# EAGLE design cape (EAGLE 7.4.0)
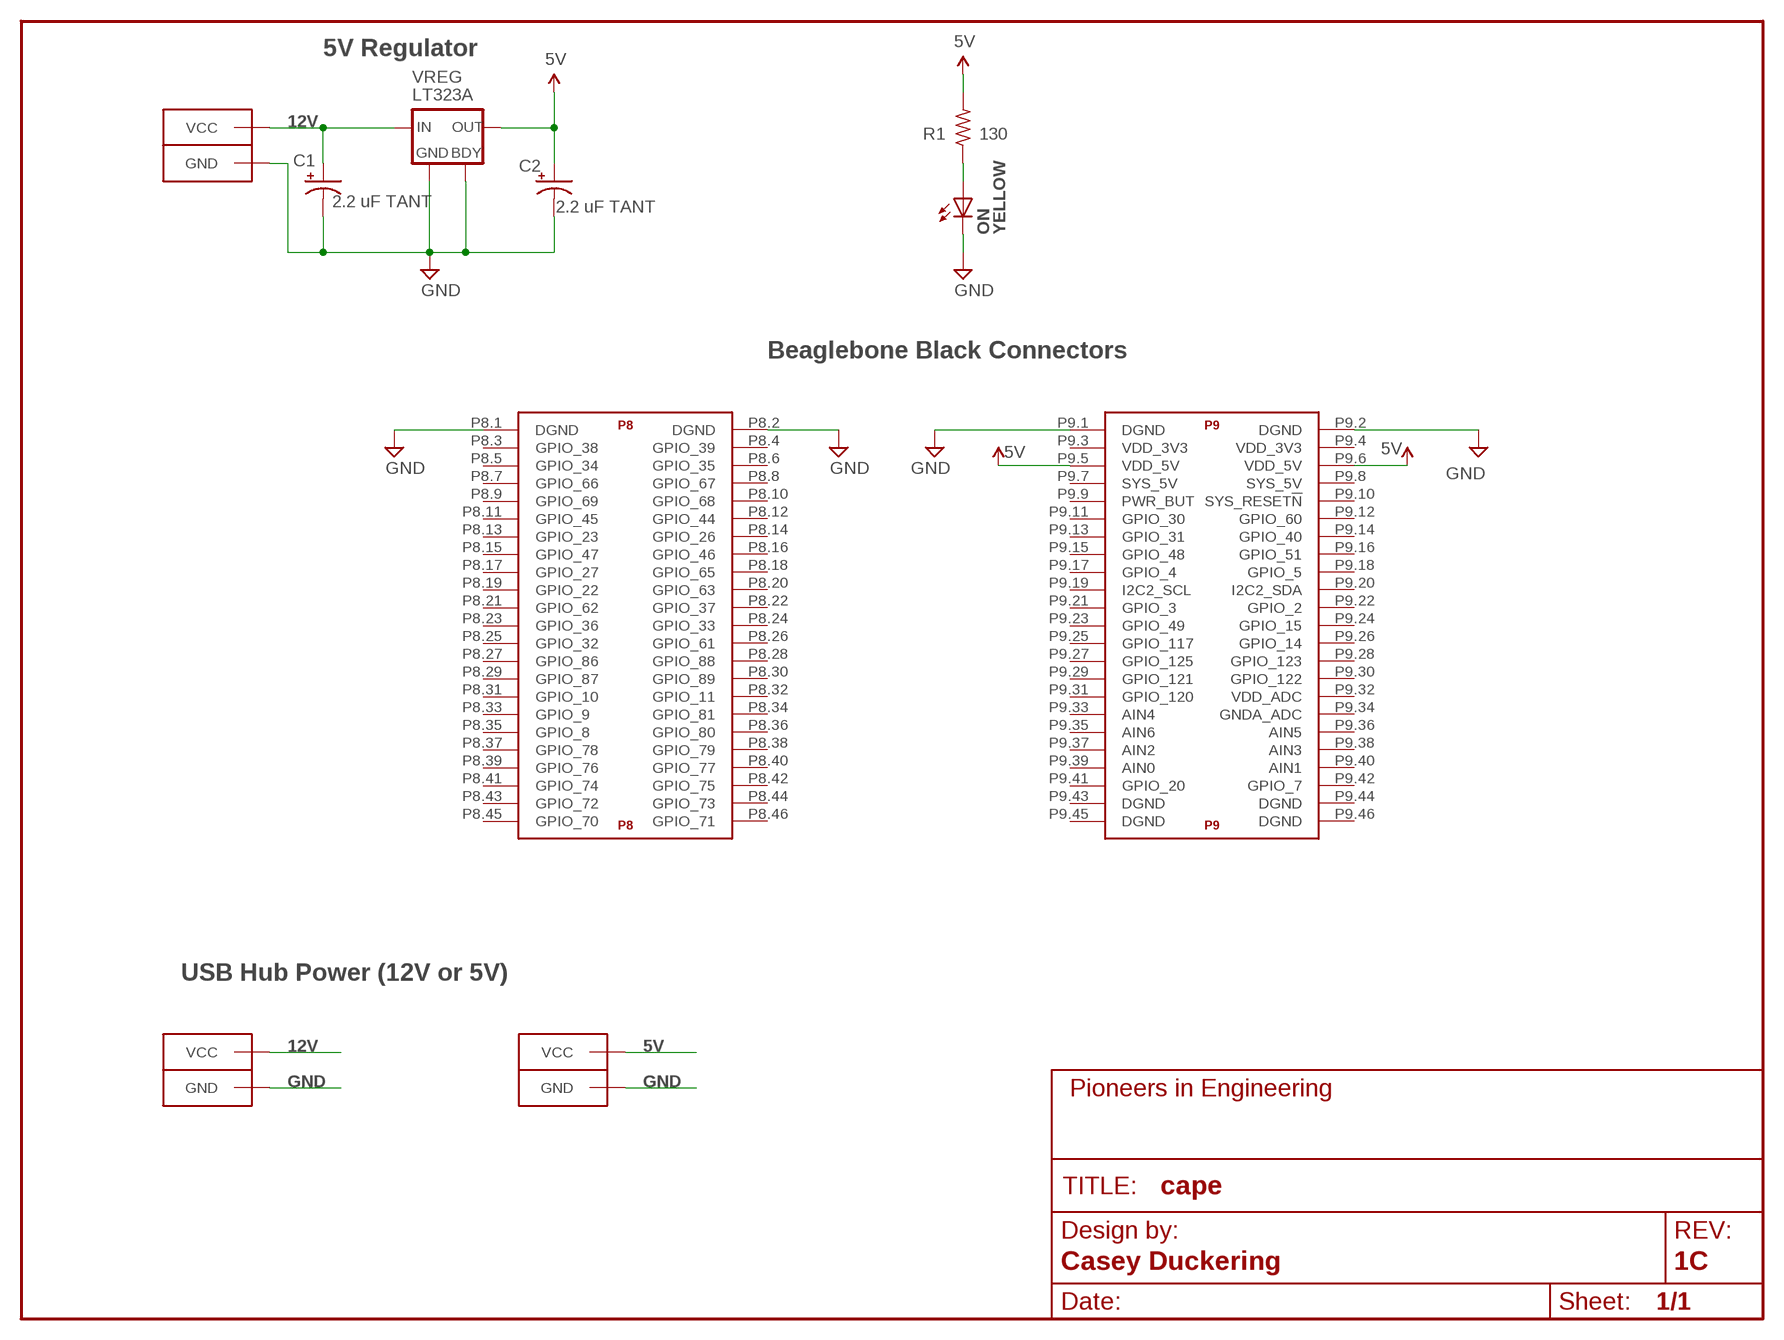
[diagram p0: schematic, sheet 1]
FRAME1 (FRAME-LETTER): AUTHOR: Casey Duckering; REVISION: 1C

## Parts
BATT  12V  ANDERSONHORIZONTAL  [ANDERSON_HORIZONTAL]
C1  2.2 uF TANT  CAP_POL1206  [EIA3216]
C2  2.2 uF TANT  CAP_POL1206  [EIA3216]
CAPE  BEAGLE_BONE_BLACK_CAPE  [BEAGLE_BONE_BLACK_CAPE]
J2  12V  POWER-WIRE  [POWER-WIRE]
J3  5V  POWER-WIRE  [POWER-WIRE]
ON  YELLOW  LED0805  [LED-0805]
R1  130  R-US_R0603  [R0603]
VREG  LT323A  V_REG_LT323A  [TO-220]

## Nets
5V: C2.A(+) CAPE.P9.5(P9:VDD_5V) CAPE.P9.6(P9:VDD_5V) J3.VCC R1.2 VREG.OUT
12V: BATT.PIN2(VCC) BATT.PIN2-LEAD(VCC) C1.A(+) J2.VCC VREG.IN
GND: BATT.PIN1(GND) BATT.PIN1-LEAD(GND) C1.C(-) C2.C(-) CAPE.P8.1(P8:DGND) CAPE.P8.2(P8:DGND) CAPE.P9.1(P9:DGND) CAPE.P9.2(P9:DGND) J2.GND J3.GND ON.C VREG.GND VREG.PAD(BDY)
N$1: ON.A R1.1
Unconnected: CAPE.P8.3(P8:GPIO_38) CAPE.P8.4(P8:GPIO_39) CAPE.P8.5(P8:GPIO_34) CAPE.P8.6(P8:GPIO_35) CAPE.P8.7(P8:GPIO_66) CAPE.P8.8(P8:GPIO_67) CAPE.P8.9(P8:GPIO_69) CAPE.P8.10(P8:GPIO_68) CAPE.P8.11(P8:GPIO_45) CAPE.P8.12(P8:GPIO_44) CAPE.P8.13(P8:GPIO_23) CAPE.P8.14(P8:GPIO_26) CAPE.P8.15(P8:GPIO_47) CAPE.P8.16(P8:GPIO_46) CAPE.P8.17(P8:GPIO_27) CAPE.P8.18(P8:GPIO_65) CAPE.P8.19(P8:GPIO_22) CAPE.P8.20(P8:GPIO_63) CAPE.P8.21(P8:GPIO_62) CAPE.P8.22(P8:GPIO_37) CAPE.P8.23(P8:GPIO_36) CAPE.P8.24(P8:GPIO_33) CAPE.P8.25(P8:GPIO_32) CAPE.P8.26(P8:GPIO_61) CAPE.P8.27(P8:GPIO_86) CAPE.P8.28(P8:GPIO_88) CAPE.P8.29(P8:GPIO_87) CAPE.P8.30(P8:GPIO_89) CAPE.P8.31(P8:GPIO_10) CAPE.P8.32(P8:GPIO_11) CAPE.P8.33(P8:GPIO_9) CAPE.P8.34(P8:GPIO_81) CAPE.P8.35(P8:GPIO_8) CAPE.P8.36(P8:GPIO_80) CAPE.P8.37(P8:GPIO_78) CAPE.P8.38(P8:GPIO_79) CAPE.P8.39(P8:GPIO_76) CAPE.P8.40(P8:GPIO_77) CAPE.P8.41(P8:GPIO_74) CAPE.P8.42(P8:GPIO_75) CAPE.P8.43(P8:GPIO_72) CAPE.P8.44(P8:GPIO_73) CAPE.P8.45(P8:GPIO_70) CAPE.P8.46(P8:GPIO_71) CAPE.P9.3(P9:VDD_3V3) CAPE.P9.4(P9:VDD_3V3) CAPE.P9.7(P9:SYS_5V) CAPE.P9.8(P9:SYS_5V) CAPE.P9.9(P9:PWR_BUT) CAPE.P9.10(P9:SYS_RESET!N) CAPE.P9.11(P9:GPIO_30) CAPE.P9.12(P9:GPIO_60) CAPE.P9.13(P9:GPIO_31) CAPE.P9.14(P9:GPIO_40) CAPE.P9.15(P9:GPIO_48) CAPE.P9.16(P9:GPIO_51) CAPE.P9.17(P9:GPIO_4) CAPE.P9.18(P9:GPIO_5) CAPE.P9.19(P9:I2C2_SCL) CAPE.P9.20(P9:I2C2_SDA) CAPE.P9.21(P9:GPIO_3) CAPE.P9.22(P9:GPIO_2) CAPE.P9.23(P9:GPIO_49) CAPE.P9.24(P9:GPIO_15) CAPE.P9.25(P9:GPIO_117) CAPE.P9.26(P9:GPIO_14) CAPE.P9.27(P9:GPIO_125) CAPE.P9.28(P9:GPIO_123) CAPE.P9.29(P9:GPIO_121) CAPE.P9.30(P9:GPIO_122) CAPE.P9.31(P9:GPIO_120) CAPE.P9.32(P9:VDD_ADC) CAPE.P9.33(P9:AIN4) CAPE.P9.34(P9:GNDA_ADC) CAPE.P9.35(P9:AIN6) CAPE.P9.36(P9:AIN5) CAPE.P9.37(P9:AIN2) CAPE.P9.38(P9:AIN3) CAPE.P9.39(P9:AIN0) CAPE.P9.40(P9:AIN1) CAPE.P9.41(P9:GPIO_20) CAPE.P9.42(P9:GPIO_7) CAPE.P9.43(P9:DGND) CAPE.P9.44(P9:DGND) CAPE.P9.45(P9:DGND) CAPE.P9.46(P9:DGND)

## Notes on the sheet
- 5V Regulator
- Beaglebone Black Connectors
- USB Hub Power (12V or 5V)

## Library data of the parts
BATT = pie:ANDERSON: 2-pin 25A Anderson Connector http://www.alliedelec.com/images/products/datasheets/bm/ANDERSON_POWER_PRODUCTS/70162018.pdf; PIE-INT-REF-NUM: Anderson
C1 C2 = pie:CAP_POL: Capacitor Polarized These are standard SMD and PTH capacitors. Normally 10uF, 47uF, and 100uF in electrolytic and tantalum varieties. Always verify the external diameter of the through hole cap, it varies with capacity, voltage, and manufacturer. The EIA devices should be standard.
CAPE = SparkFun-Boards:BEAGLE_BONE_BLACK_CAPE
J2 J3 = pie:POWER-WIRE
ON = pie:LED: LEDs Standard schematic elements and footprints for 5mm, 3mm, 1206, and 0603 sized LEDs. 5mm - Spark Fun Electronics SKU : COM-00529 (and others); PIE-INT-REF-NUM: LED
R1 = pie:R-US_: RESISTOR, American symbol; PIE-INT-REF-NUM: RESISTOR-GENERIC
VREG = pie:V_REG_LT323A: Voltage Regulator Standard 7805 5V regulator. IGO (Input Ground Output). Spark Fun Electronics SKU : COM-00107

## Board
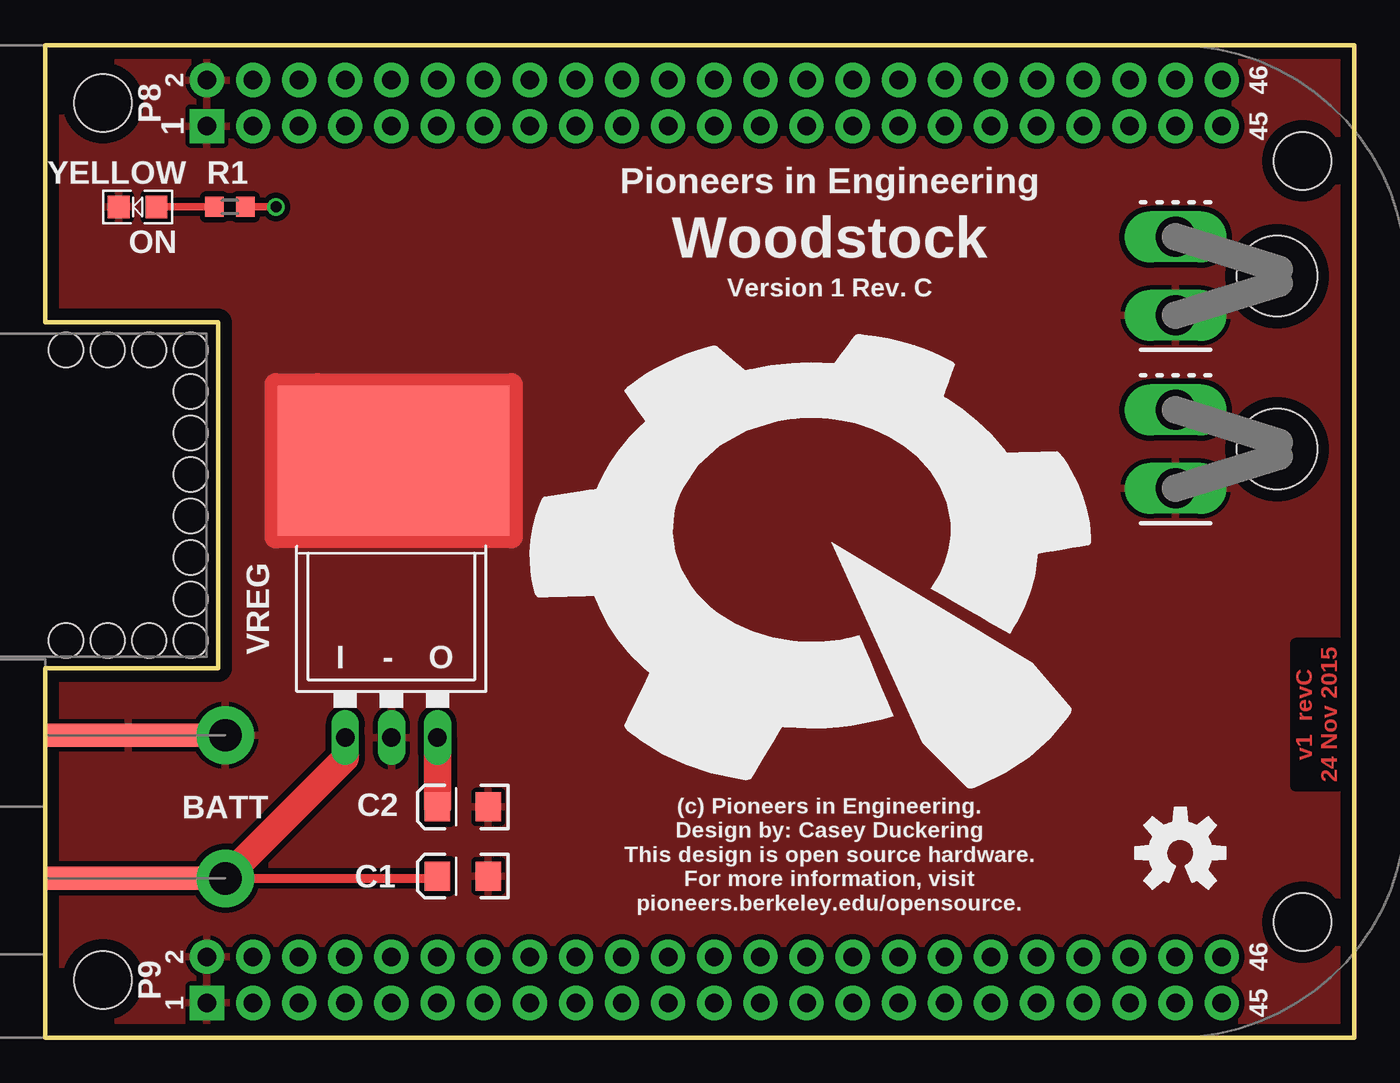
[diagram p1: board, top side]
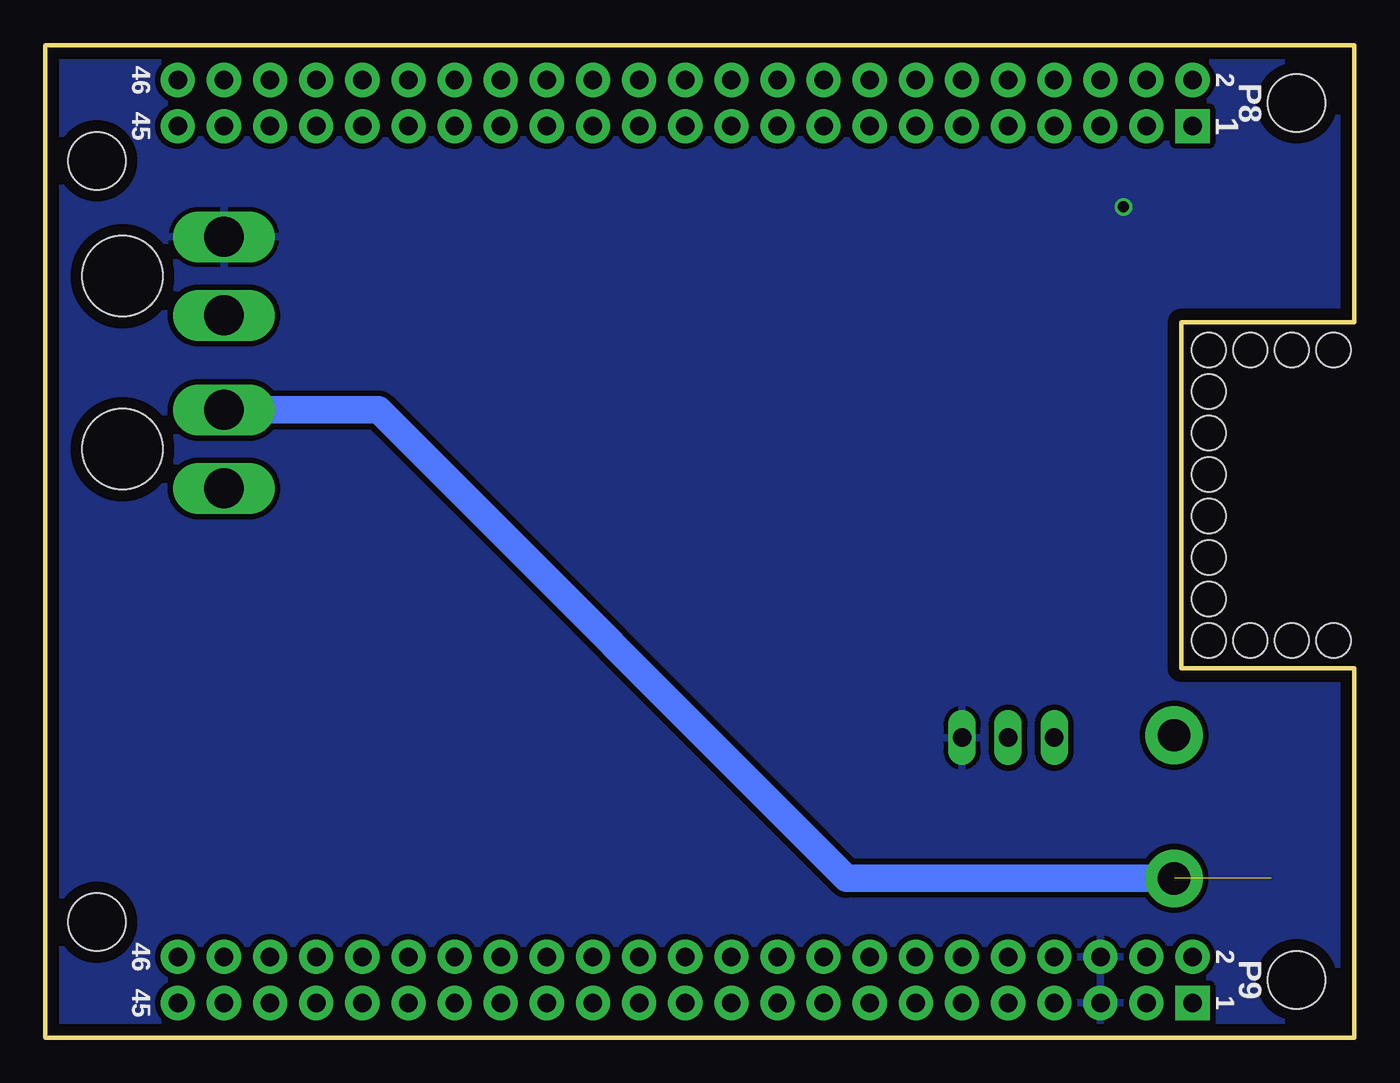
[diagram p2: board, bottom side, seen from below]

Size 72.06 x 54.61 mm. Coordinates in mm from the lower left corner, seen from the top.
Outline: 0,0 72.06,0 72.06,54.61 0,54.61 0,39.37 9.53,39.37 9.53,20.32 0,20.32 0,0
Copper layers (1*16): Top 2mil / dielectric 9mil / Bottom 2mil
Design rules "advancedcircuits-33each-pie": minimum track width 6mil, minimum drill 15mil, track to track 6mil, track to pad 6mil, pad to pad 6mil, via to via 6mil, smd to smd 6mil, copper to edge 25mil, drill to drill 7mil, minimum pad ring 7mil, minimum via ring 7mil, stop-mask expansion 3mil, vias tented up to drill 21mil, thermal gap 10mil
Holes 1.91 mm at 1.14,21.84 3.43,21.84 5.71,21.84 8,21.84 8,28.7 8,26.42 8,24.13 8,30.99 8,35.56 8,33.27 1.14,37.85 3.43,37.85 5.71,37.85 8,37.85

### Footprints (pad centres in the part's own frame; a part is rotated, then mirrored left to right if it is on the bottom)
ANDERSON_HORIZONTAL = drill 1.778 pad 3.175: PIN1 0,3.937; PIN2 0,-3.937 | smd 8.89 x 1.27: PIN1-LEAD -5.334,3.937; PIN2-LEAD -5.334,-3.937
EIA3216 = smd 1.4 x 1.6: A 1.4,0; C -1.4,0
BEAGLE_BONE_BLACK_CAPE = drill 1.016 pad 1.88 square: P8.1 20.32,50.165; P9.1 20.32,1.905 | drill 1.016 pad 1.88: P8.2 20.32,52.705; P8.3 22.86,50.165; P8.4 22.86,52.705; P8.5 25.4,50.165; P8.6 25.4,52.705; P8.7 27.94,50.165; P8.8 27.94,52.705; P8.9 30.48,50.165; P8.10 30.48,52.705; P8.11 33.02,50.165; P8.12 33.02,52.705; P8.13 35.56,50.165; P8.14 35.56,52.705; P8.15 38.1,50.165; P8.16 38.1,52.705; P8.17 40.64,50.165; P8.18 40.64,52.705; P8.19 43.18,50.165; P8.20 43.18,52.705; P8.21 45.72,50.165; P8.22 45.72,52.705; P8.23 48.26,50.165; P8.24 48.26,52.705; P8.25 50.8,50.165; P8.26 50.8,52.705; P8.27 53.34,50.165; P8.28 53.34,52.705; P8.29 55.88,50.165; P8.30 55.88,52.705; P8.31 58.42,50.165; P8.32 58.42,52.705; P8.33 60.96,50.165; P8.34 60.96,52.705; P8.35 63.5,50.165; P8.36 63.5,52.705; P8.37 66.04,50.165; P8.38 66.04,52.705; P8.39 68.58,50.165; P8.40 68.58,52.705; P8.41 71.12,50.165; P8.42 71.12,52.705; P8.43 73.66,50.165; P8.44 73.66,52.705; P8.45 76.2,50.165; P8.46 76.2,52.705; P9.2 20.32,4.445; P9.3 22.86,1.905; P9.4 22.86,4.445; P9.5 25.4,1.905; P9.6 25.4,4.445; P9.7 27.94,1.905; P9.8 27.94,4.445; P9.9 30.48,1.905; P9.10 30.48,4.445; P9.11 33.02,1.905; P9.12 33.02,4.445; P9.13 35.56,1.905; P9.14 35.56,4.445; P9.15 38.1,1.905; P9.16 38.1,4.445; P9.17 40.64,1.905; P9.18 40.64,4.445; P9.19 43.18,1.905; P9.20 43.18,4.445; P9.21 45.72,1.905; P9.22 45.72,4.445; P9.23 48.26,1.905; P9.24 48.26,4.445; P9.25 50.8,1.905; P9.26 50.8,4.445; P9.27 53.34,1.905; P9.28 53.34,4.445; P9.29 55.88,1.905; P9.30 55.88,4.445; P9.31 58.42,1.905; P9.32 58.42,4.445; P9.33 60.96,1.905; P9.34 60.96,4.445; P9.35 63.5,1.905; P9.36 63.5,4.445; P9.37 66.04,1.905; P9.38 66.04,4.445; P9.39 68.58,1.905; P9.40 68.58,4.445; P9.41 71.12,1.905; P9.42 71.12,4.445; P9.43 73.66,1.905; P9.44 73.66,4.445; P9.45 76.2,1.905; P9.46 76.2,4.445 | hole 3.175: 14.605,3.175; 80.645,6.35; 80.645,48.26; 14.605,51.435
POWER-WIRE = drill 2.2 pad 2.794 long: GND 0,-2.159; VCC 0,2.159 | hole 4.445: 5.588,0
LED-0805 = smd 1.194 x 1.245: A -1.041,0; C 1.041,0
R0603 = smd 1 x 1.1: 1 -0.85,0; 2 0.85,0
TO-220 = drill 1.016 pad 1.524 long: GND 0,-8.89; IN -2.54,-8.89; OUT 2.54,-8.89 | smd 12.7 x 8.255: PAD 0.127,6.35

### Placement (x,y rotation side)
BATT  9.91,12.7 0 top
C1  22.99,8.89 180 top
C2  22.99,12.7 180 top
CAPE  -11.43,0 0 top
J2  62.23,32.38 0 top
J3  62.23,41.91 0 top
ON  5.08,45.72 180 top
R1  10.16,45.72 0 top
U$3  [OSHW-LOGO-M]  62.48,10.16 0 top
U$6  [PIE-LOGO]  43.18,27.05 0 top
VREG  19.05,25.4 0 top

### Tracks (layer width: path | path; a pad name or v marks a point on that pad's centre or on a via)
5V  (via drill 0.6)
  Top 0.406: R1.2 v12.7,45.72
  Top 0.508: VREG.OUT
  Top 1.524: VREG.OUT C2.A
  pour Bottom (isolate 0.305): 0,0 0,54.61 72.39,54.61 72.39,0
12V  (1 unrouted)
  Top 0.508: BATT.PIN2 21.59,8.76 C1.A
  Top 0.61: 10.29,9.14 10.29,8.89 10.03,8.89 BATT.PIN2
  Top 1.524: VREG.IN 16.51,15.37 10.29,9.14
  Bottom 0.61: 11.94,8.89 10.03,8.89 BATT.PIN2
  Bottom 1.524: BATT.PIN2 27.94,8.76 53.72,34.54 J2.VCC
GND
  Top 1.27: 14.99,35.94 25.65,35.94 25.65,27.56 12.7,27.56 12.7,35.94 14.99,35.94 | 14.99,35.94 VREG.PAD
  pour Top (isolate 0.305): 0,0 0,54.61 72.39,54.61 72.39,0
N$1
  Top 0.406: ON.A R1.1

### Text on the board
Top: v1 revC / 24 Nov 2015
tPlace: Pioneers in Engineering | Woodstock | Version 1 Rev. C | (c) Pioneers in Engineering. / Design by: Casey Duckering / This design is open source hardware. / For more information, visit / pioneers.berkeley.edu/opensource.
tValues: GND | 12V